# EasyEDA Pro project OPS9.epro

# Schematic Schematic1
Board Name: Board1; Create Date: 2024-11-01; Page Name: P1; Project Name: ops9; Schematic Name: Schematic1; Update Date: 2024-11-03; Company: 嘉立创EDA; Page Size: A4; Version: V1.0
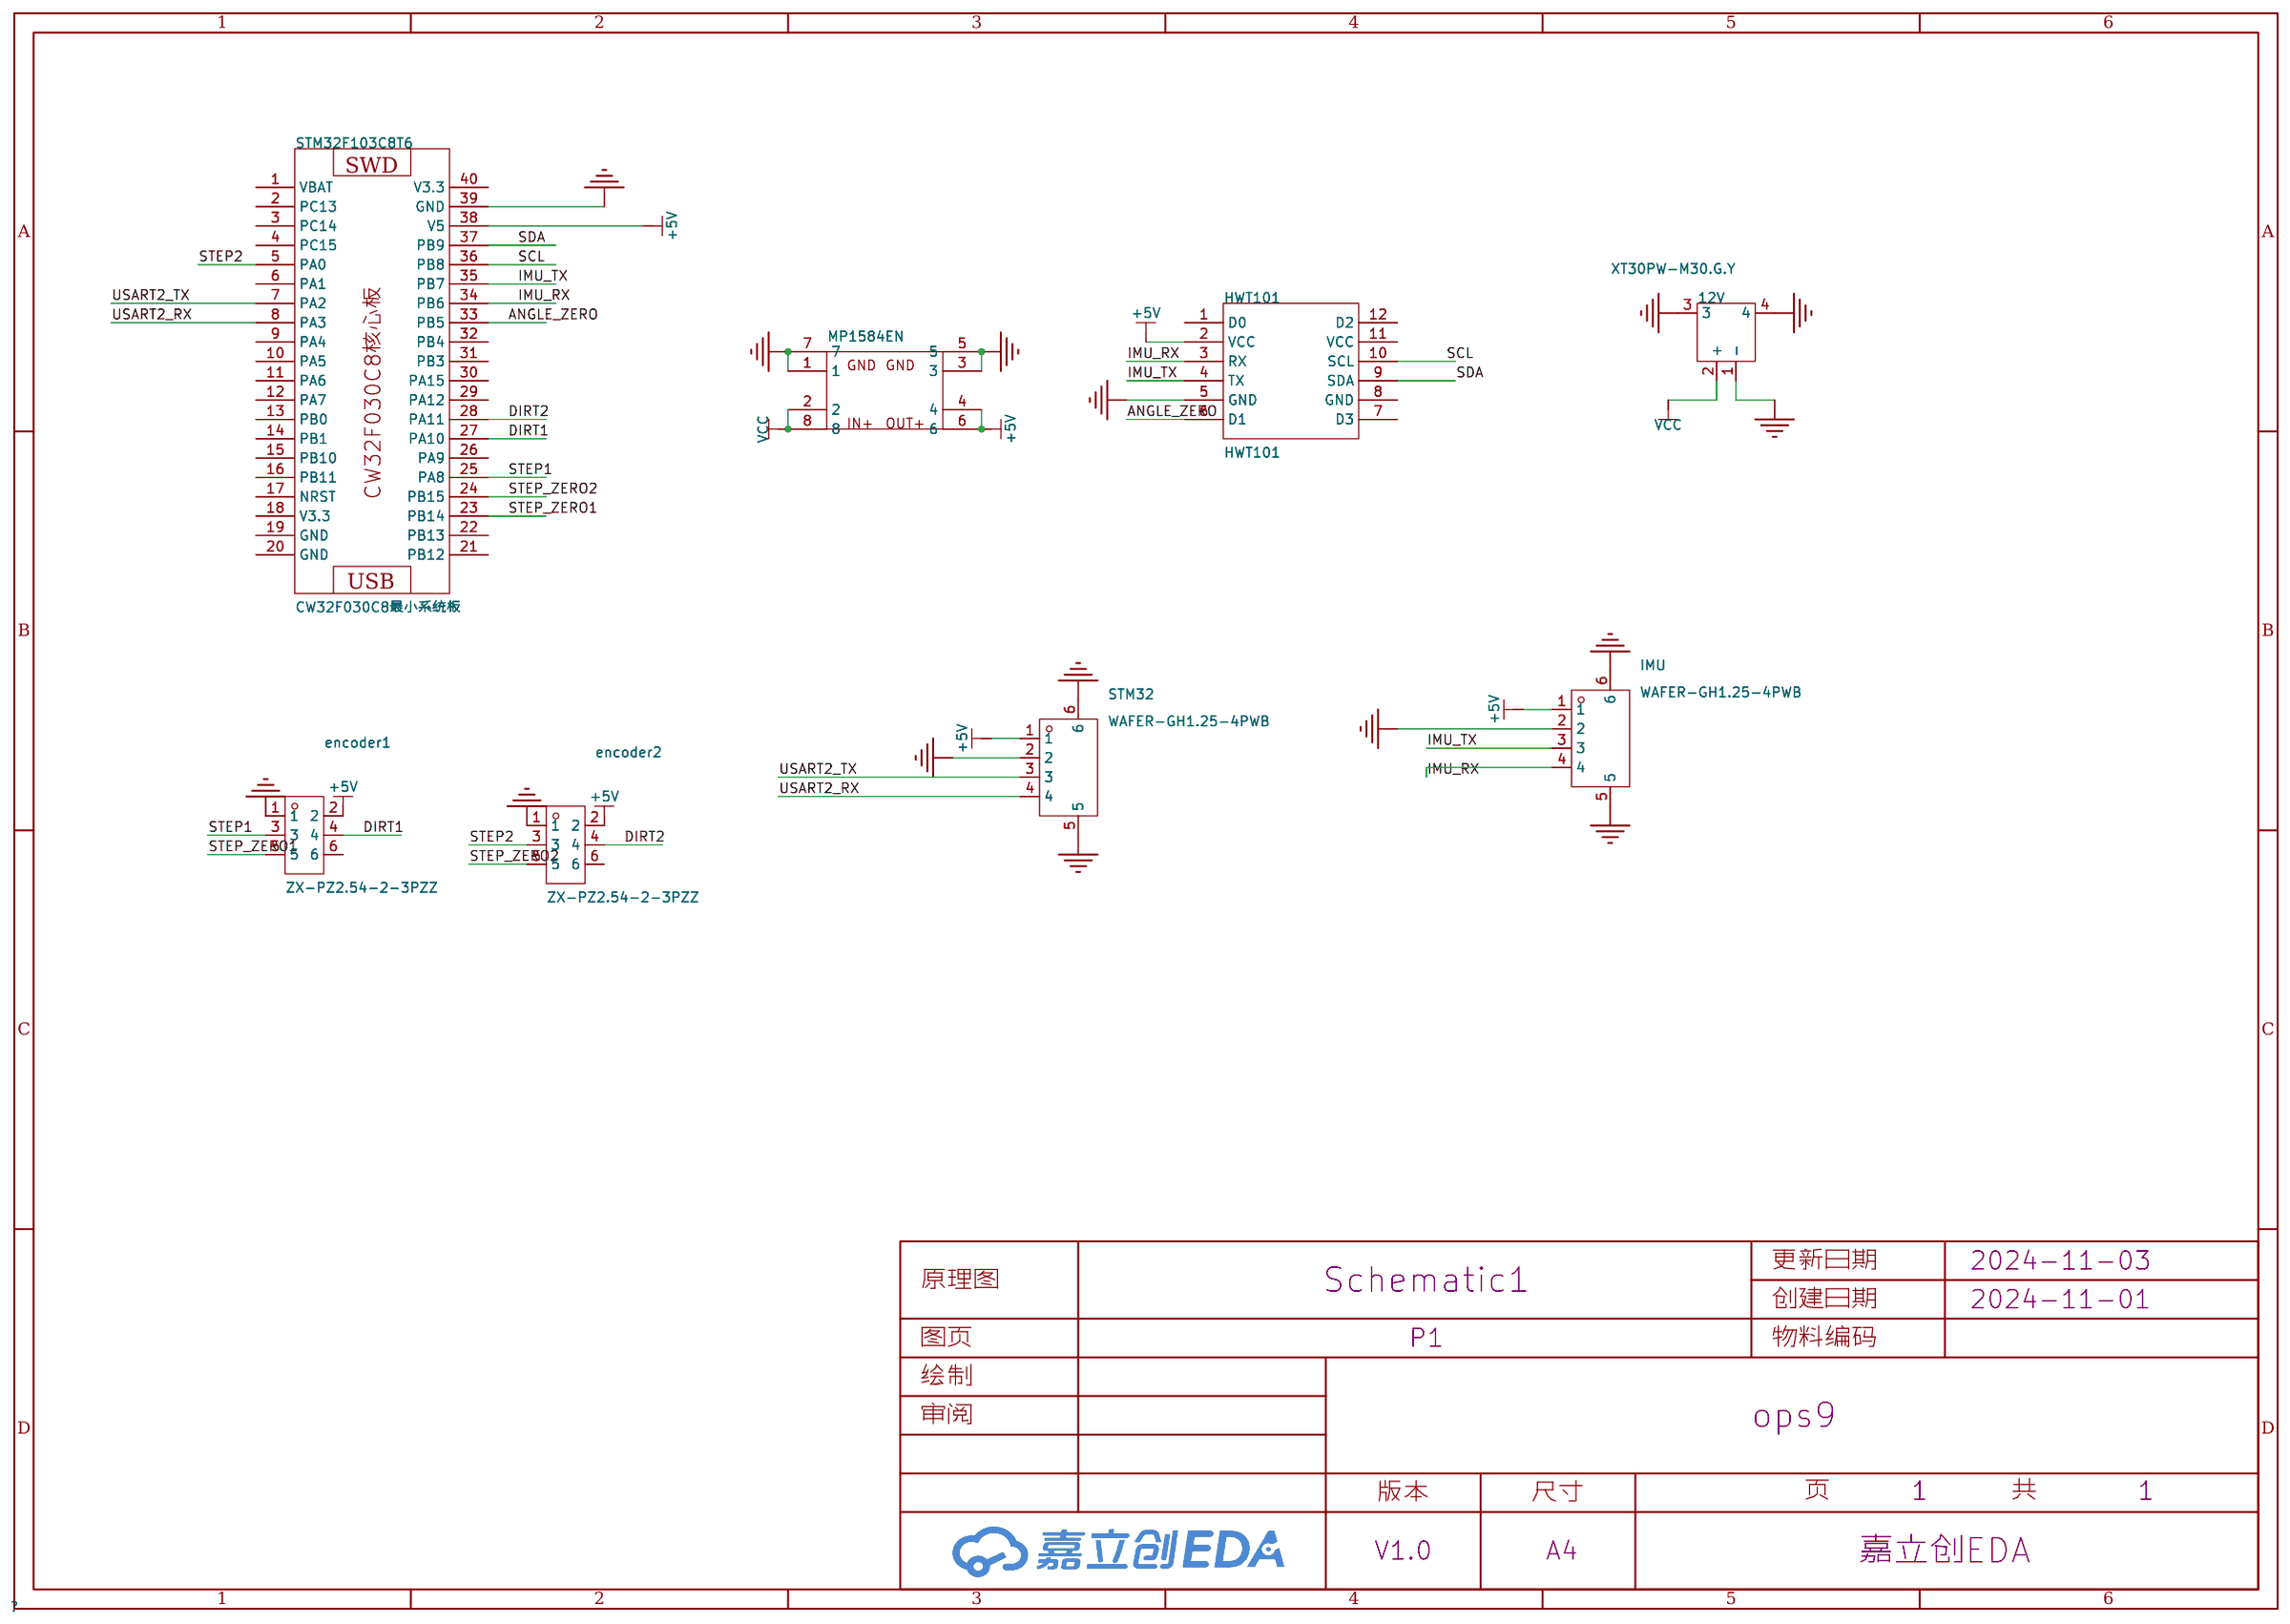
[diagram p0: schematic sheet]

## Parts
12V  XT30PW-M30.G.Y  [CONN-TH_XT30PW-M]
encoder1  ZX-PZ2.54-2-3PZZ  [HDR-TH_6P-P2.54-V-M-R2-C3-S2.54-1]
encoder2  ZX-PZ2.54-2-3PZZ  [HDR-TH_6P-P2.54-V-M-R2-C3-S2.54-1]
HWT101  HWT101  [HWT101]
IMU  WAFER-GH1.25-4PWB  [CONN-SMD_4P-P1.25_XUNPU_WAFER-GH1.25-4PWB]
MP1584EN  -  [LM1584EN]
STM32  WAFER-GH1.25-4PWB  [CONN-SMD_4P-P1.25_XUNPU_WAFER-GH1.25-4PWB]
STM32F103C8T6  CW32F030C8最小系统板  [STM32F103C8T6核心板]

## Library data of the parts
12V = XT30PW-M30.G.Y: 类别:-;类型1:-;; LCSC Part Name: AMASS(艾迈斯)航模插头 卧式弯脚 XT30PW-M公头; Supplier Part: C431092; Manufacturer: AMASS(艾迈斯); JLCPCB Part Class: 扩展库; Datasheet: https://atta.szlcsc.com/upload/public/pdf/source/20220222/6A9F22F7850E25B33E1BE430ADF8560B.pdf; Supplier: LCSC; Type: 航模插头; RatedVoltage: DC 500V; InterfaceType: 公头; RatedCurrent: 15A; RecommendedWireGauge: 16/18/20AWG; contact resistance: 1.2mΩ; specifications: 2pin
encoder1 encoder2 = ZX-PZ2.54-2-3PZZ: 插针结构:2x3P;间距:2.54mm;行距:2.54mm;圆针/方针:方针;安装类型:直插;排数:双排;总PIN位数:6P;额定电流:3A;额定电压:1kV;配合针长度:6mm;塑高:2.5mm;端接针长度:3mm;触头材质:黄铜;触头镀层:金;工作温度范围:-40℃~+105℃;焊接温度(最大值):-;颜色:黑色;; LCSC Part Name: 2x3P 间距:2.54mm 方针 直插; Supplier Part: C7501274; Manufacturer: Megastar(兆星); Supplier Footprint: 插件,P=2.54mm; JLCPCB Part Class: 扩展库; Datasheet: https://atta.szlcsc.com/upload/public/pdf/source/20231122/E8390501A702A71E626C593F036B3607.pdf; Supplier: LCSC; Pin Structure: 2x3P; Pitch: 2.54mm; Row Spacing: 2.54mm; Circluar Pins/Square Pins: 方针; Mounting Type: 直插; Number of Rows: 双排; Number of Pins: 6P; Current Rating (Max): 3A; Voltage Rating (Max): 1kV; Length of Mating Pin: 6mm; Insulation Height: 2.5mm; Length of End Connection Pin: 3mm; Contact Material: 黄铜; Contact Plating: 金; Operating Temperature Range: -40℃~+105℃; Color: 黑色
HWT101 = HWT101: _: 3
IMU STM32 = WAFER-GH1.25-4PWB: 插针结构:1x4P;间距:1.25mm;安装方式:卧贴;参考系列:GH;总PIN数:4P;排数:1;每排PIN数:4;额定电流:1A;工作温度范围:-25℃~+85℃;; LCSC Part Name: 1x4P 间距:1.25mm 卧贴 系列:GH; Supplier Part: C3029379; Manufacturer: XUNPU(讯普); Supplier Footprint: SMD,P=1.25mm,卧贴; JLCPCB Part Class: 扩展库; Datasheet: https://atta.szlcsc.com/upload/public/pdf/source/20220527/CB8773BFB0913C3B8ABD62CB38BA101A.pdf; Supplier: LCSC; Pins Structure: 1x4P; Pitch: 1.25mm; Mounting Style: 卧贴; Reference Series: GH; Number of Pins: 4P; Number of Rows: 1; Number of PINs Per Row: 4; Current Rating (Max): 1A; Operating Temperature Range: -25℃~+85℃
MP1584EN = MP1584EN
STM32F103C8T6 = CW32F030C8最小系统板: tags: STM32; Supplier Part: C8734; Manufacturer: 无; Manufacturer Part: STM32F103C8T6最小系统模块; image: http://image.lceda.cn/szlcsc/C8734.jpg; JLCPCB Part Class: Basic Part

## Nets
+5V: encoder1.2 encoder2.2 HWT101.2(VCC) IMU.1 MP1584EN.4 MP1584EN.6 STM32.1 STM32F103C8T6.38(V5)
GND: 12V.1(-) 12V.3 12V.4 encoder1.1 encoder2.1 HWT101.5(GND) IMU.2 IMU.5 IMU.6 MP1584EN.1 MP1584EN.3 MP1584EN.5 MP1584EN.7 STM32.2 STM32.5 STM32.6 STM32F103C8T6.39(GND)
VCC: 12V.2(+) MP1584EN.2 MP1584EN.8
ANGLE_ZERO: HWT101.6(D1) STM32F103C8T6.33(PB5)
DIRT1: encoder1.4 STM32F103C8T6.27(PA10)
DIRT2: encoder2.4 STM32F103C8T6.28(PA11)
IMU_RX: HWT101.3(RX) IMU.4 STM32F103C8T6.34(PB6)
IMU_TX: HWT101.4(TX) IMU.3 STM32F103C8T6.35(PB7)
SCL: HWT101.10(SCL) STM32F103C8T6.36(PB8)
SDA: HWT101.9(SDA) STM32F103C8T6.37(PB9)
STEP1: encoder1.3 STM32F103C8T6.25(PA8)
STEP2: encoder2.3 STM32F103C8T6.5(PA0)
STEP_ZERO1: encoder1.5 STM32F103C8T6.23(PB14)
STEP_ZERO2: encoder2.5 STM32F103C8T6.24(PB15)
USART2_RX: STM32.4 STM32F103C8T6.8(PA3)
USART2_TX: STM32.3 STM32F103C8T6.7(PA2)

Not connected (* = marked no-connect by the designer): encoder1 6; encoder2 6; HWT101 1(D0) 7(D3) 8(GND) 11(VCC) 12(D2); STM32F103C8T6 1(VBAT) 2(PC13) 3(PC14) 4(PC15) 6(PA1) 9(PA4) 10(PA5) 11(PA6) 12(PA7) 13(PB0) 14(PB1) 15(PB10) 16(PB11) 17(NRST) 18(V3.3) 19(GND) 20(GND) 21(PB12) 22(PB13) 26(PA9) 29(PA12) 30(PA15) 31(PB3) 32(PB4) 40(V3.3)

# Board PCB1
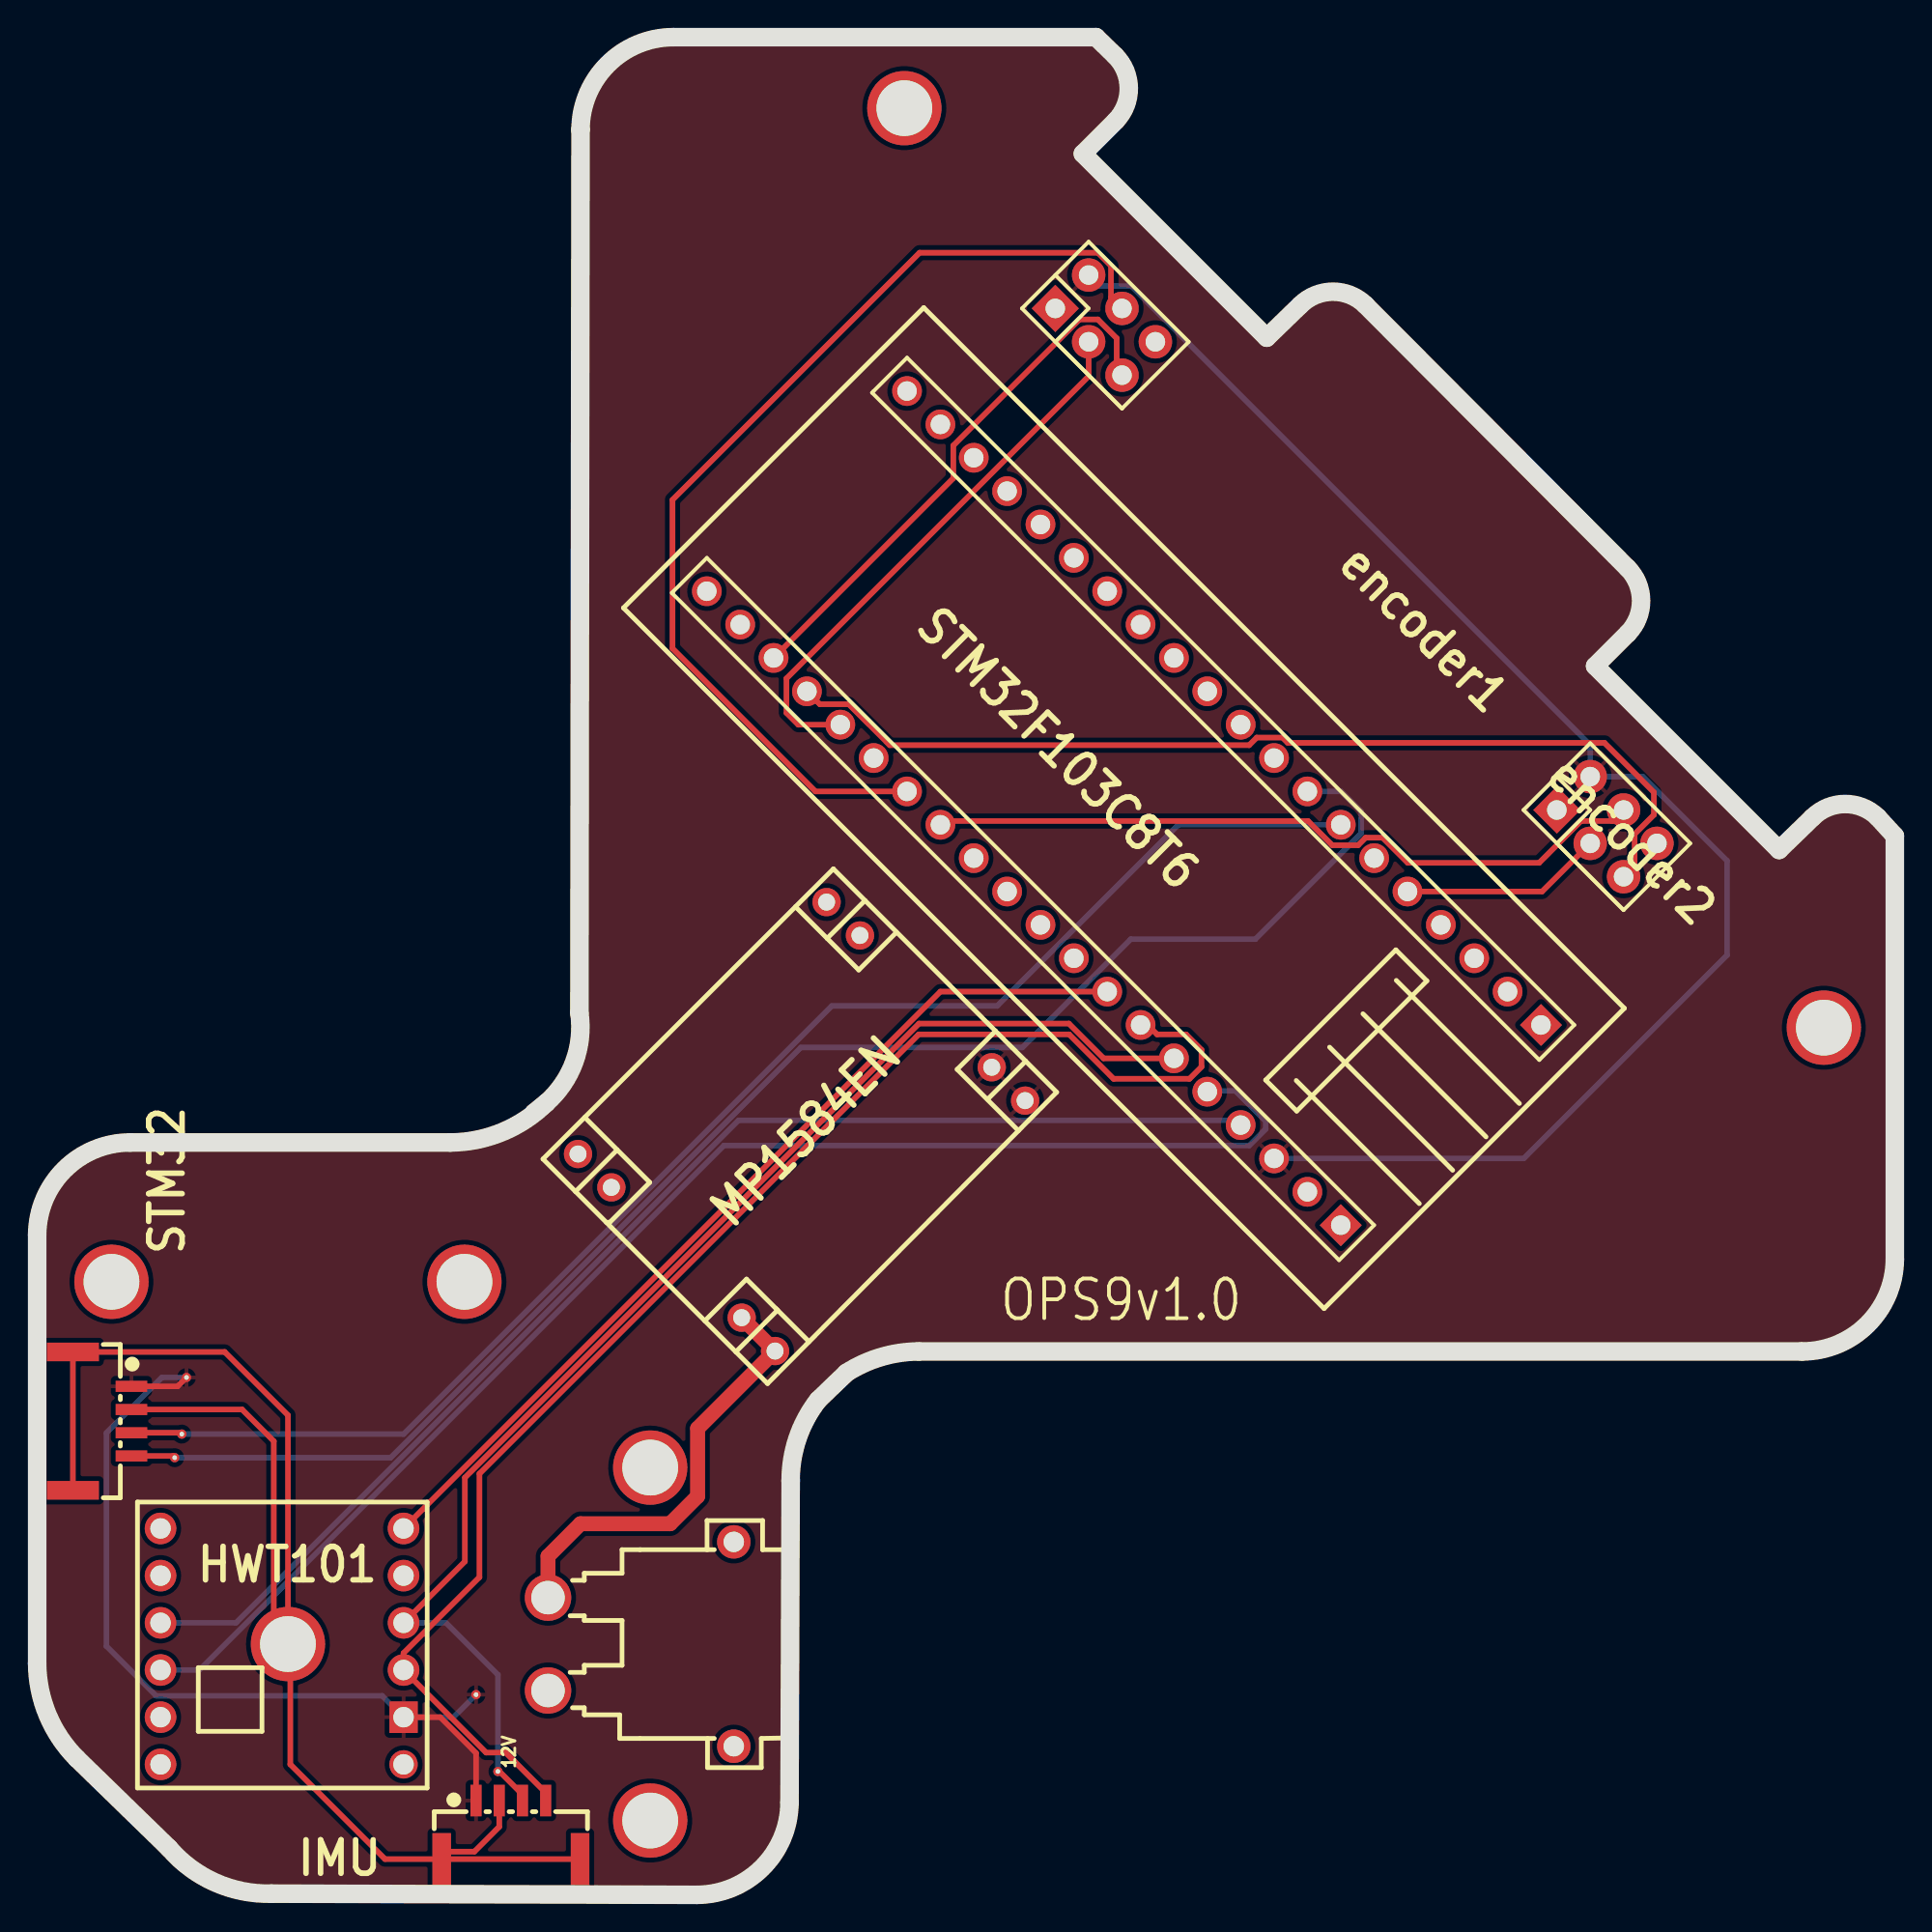
[diagram p1: board, top side]
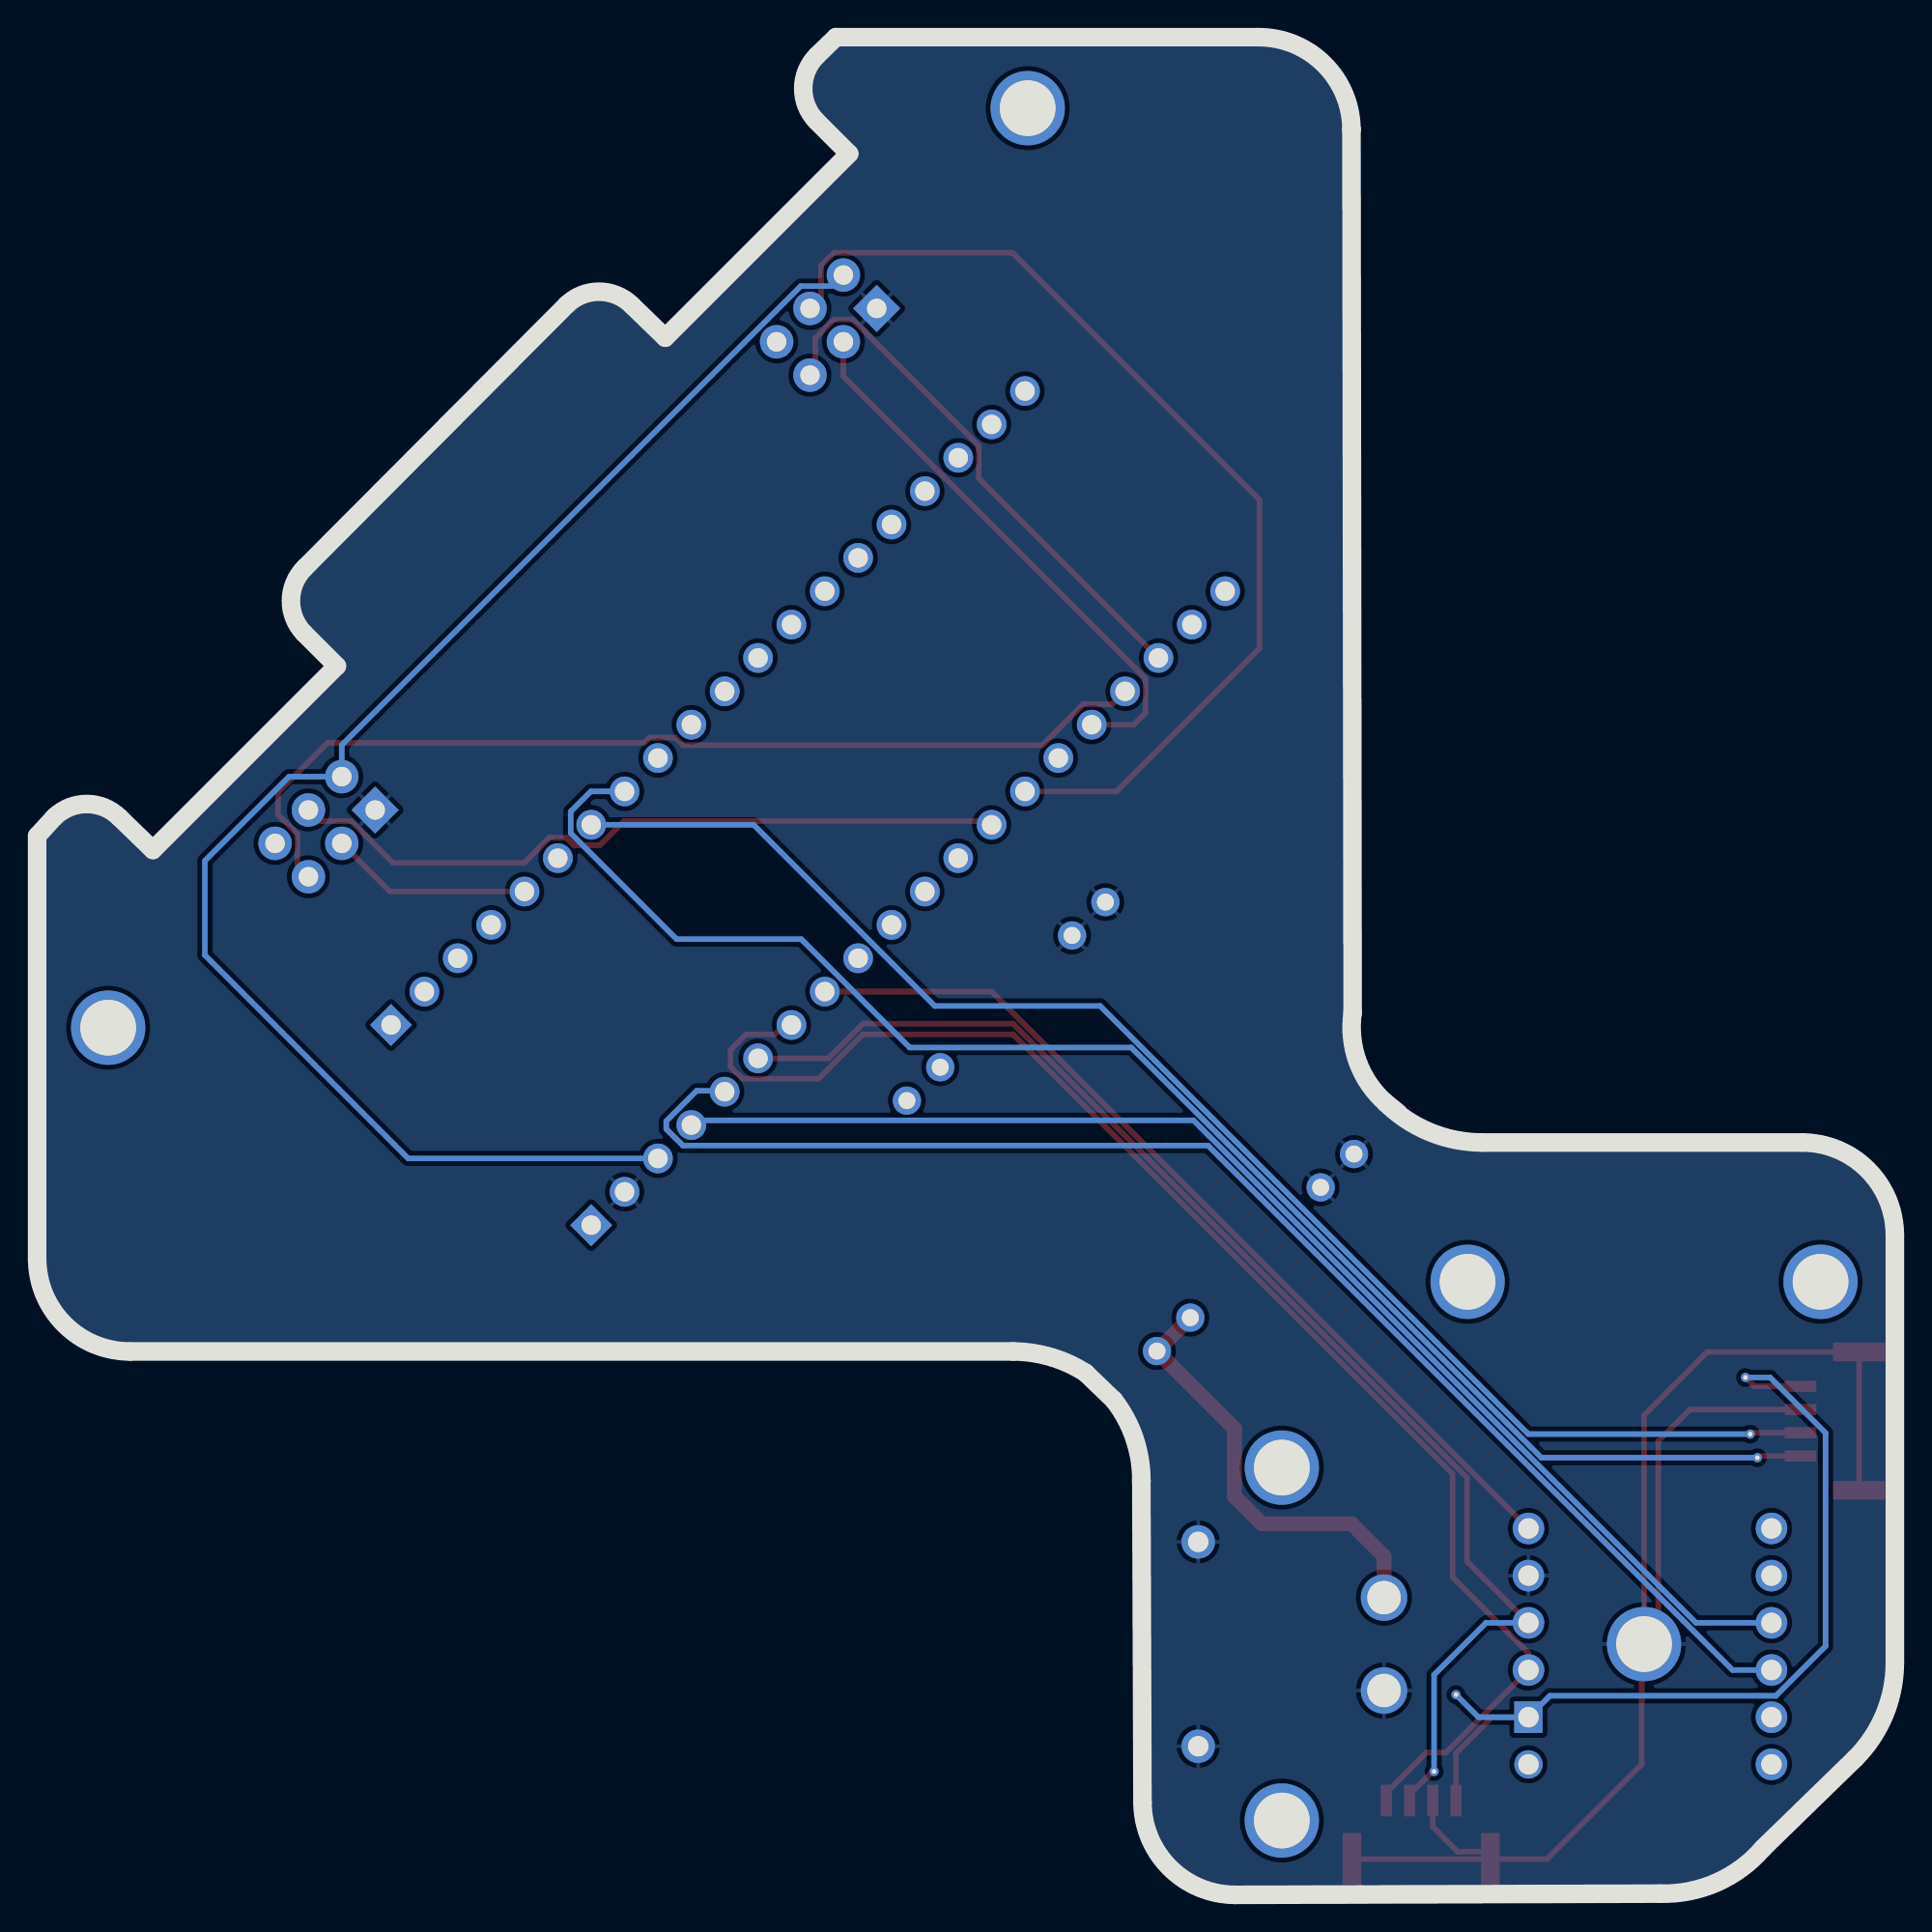
[diagram p2: board, bottom side, seen from below]

Outline 100 x 100 mm; copper layers: Top Layer, Bottom Layer. Coordinates in mm from the lower left corner of the outline.
Outline path: 27.41,42.64 arc(25.04,41.06) 22.25,40.5 5,40.5 arc(1.48,39.05) 0,35.53 0,12.45 arc(0.56,9.69) 2.14,7.34 7.1,2.51 arc(9.58,0.67) 12.61,0.06 35.5,0 arc(39.02,1.45) 40.5,4.97 40.56,22.32 40.56,22.27 arc(40.93,24.58) 42.04,26.63 43.57,28.1 arc(45.43,28.95) 47.45,29.25 95,29.25 arc(98.52,30.7) 100,34.22 100,57 99.07,58.02 arc(97.31,58.72) 95.56,57.99 93.77,56.25 83.87,66.15 85.64,67.92 arc(86.34,69.67) 85.61,71.42 71.49,85.59 arc(69.73,86.3) 67.99,85.57 66.19,83.83 56.29,93.72 58.06,95.49 arc(58.76,97.25) 58.03,99 57,100 34.25,100 arc(30.73,98.55) 29.25,95.03 29.25,95 29.19,47.48 arc(28.91,44.83) 27.41,42.64 ; 27.41,42.64 26.74,42.1
Stack: Top Layer 0.035mm / Dielectric1 1.51mm FR4 er 4.5 / Bottom Layer 0.035mm

## Design rules (mm)
template: JLCPCB Capability(Two Layers Board)
spacing copperThickness1oz (default): track to track 0.102, other pairs 0.152 to 0.3
spacing copperThickness2oz: track to track 0.203, other pairs 0.152 to 0.3
track width copperThickness1oz (default): min 0.127, default 0.254, max 2.54
track width copperThickness2oz: min 0.203, default 0.254, max 2.54
differential pair differentialPair (default): width min 0.127, default 0.254, max 2.54; gap min 0.152, default 0.152
via viaSize (default): diameter min 0.5, default 0.61, max 10; hole min 0.3, default 0.305, max 6.3

## Placement (name value [footprint] x y rotation side)
12V  XT30PW-M30.G.Y  [CONN-TH_XT30PW-M]  32.5 13.5 90 top
encoder1  ZX-PZ2.54-2-3PZZ  [HDR-TH_6P-P2.54-V-M-R2-C3-S2.54-1]  57.5 84.5 315 top
encoder2  ZX-PZ2.54-2-3PZZ  [HDR-TH_6P-P2.54-V-M-R2-C3-S2.54-1]  84.5 57.5 315 top
HWT101  -  [HWT101]  13.5 13.5 180 top
IMU  WAFER-GH1.25-4PWB  [CONN-SMD_4P-P1.25_XUNPU_WAFER-GH1.25-4PWB]  25.5 3.5 0 top
MP1584EN  -  [LM1584EN]  38.77 42.08 45 top
NOREF  -  [Pad_e398]  7.4 23.53 0 top
NOREF#2  -  [Pad_e28]  23 33 0 top
NOREF#3  -  [Pad_e22]  33 23 0 top
NOREF#4  -  [Pad_e56]  96.18 46.68 0 top
NOREF#5  -  [Pad_e1201]  24.8 6.64 0 top
NOREF#6  -  [Pad_e33]  33 4 0 top
NOREF#7  -  [Pad_e1805]  23.62 10.78 0 top
NOREF#8  -  [Pad_e1290]  8.04 27.85 0 top
NOREF#9  -  [Pad_e15]  13.5 13.5 180 top
NOREF#10  -  [Pad_e397]  7.78 24.8 0 top
NOREF#11  -  [Pad_e53]  46.68 96.18 0 top
NOREF#12  -  [Pad_e30]  4 33 0 top
STM32  WAFER-GH1.25-4PWB  [CONN-SMD_4P-P1.25_XUNPU_WAFER-GH1.25-4PWB]  3.5 25.5 270 top
STM32F103C8T6  CW32F030C8最小系统板  [STM32F103C8T6核心板]  58.5 58.5 225 top

## Footprints (pads in the part's own frame, mm; a bottom-side part is the same pattern mirrored in y, then rotated)
CONN-SMD_4P-P1.25_XUNPU_WAFER-GH1.25-4PWB
  rect 0.6x1.7 smd: 1(-1.875,1.575) 2(-0.625,1.575) 3(0.625,1.575) 4(1.875,1.575)
  rect 1x2.8 smd: 5(3.725,-1.575) 6(-3.725,-1.575)
CONN-TH_XT30PW-M
  round 2.5 hole 1.8: 1(-2.5,5) 2(2.5,5)
  round 1.8 hole 1.1: 3(5.5,-5) 4(-5.5,-5)
HDR-TH_6P-P2.54-V-M-R2-C3-S2.54-1
  rect 1.8x1.8 hole 1.05: 1(-2.54,-1.27)
  round 1.8 hole 1.05: 2(-2.54,1.27) 3(0,-1.27) 4(0,1.27) 5(2.54,-1.27) 6(2.54,1.27)
HWT101
  round 1.524 hole 1.1: 1(-6.223,6.477)
  rect 1.524x1.7 hole 1.1: 2(-6.223,3.937)
  round 1.7 hole 1.1: 3(-6.223,1.397) 4(-6.223,-1.143) 5(-6.223,-3.683) 6(-6.223,-6.223) 7(6.858,-6.223) 8(6.858,-3.683) 9(6.858,-1.143) 10(6.858,1.397) 11(6.858,3.937) 12(6.858,6.477)
LM1584EN
  round 1.524 hole 0.914: 1(-8.382,2.737) 2(-8.382,-7.182) 3(10.668,2.865) 4(10.668,-7.168) 5(10.668,5.404) 6(10.668,-9.709) 7(-8.382,5.277) 8(-8.382,-9.723)
Pad_e15
  round 4 hole 3: 1(0,0)
Pad_e22
  round 4 hole 3: 1(0,0)
Pad_e28
  round 4 hole 3: 1(0,0)
Pad_e30
  round 4 hole 3: 2(0,0)
Pad_e33
  round 4 hole 3: 1(0,0)
Pad_e53
  round 4 hole 3: 1(0,0)
Pad_e56
  round 4 hole 3: 1(0,0)
Pad_e397
  round 0.5 hole 0.25: 1(0,0)
Pad_e398
  round 0.5 hole 0.25: 2(0,0)
Pad_e1201
  round 0.5 hole 0.25: 1(0,0)
Pad_e1290
  round 0.5 hole 0.25: 1(0,0)
Pad_e1805
  round 0.5 hole 0.25: 1(0,0)
STM32F103C8T6核心板
  rect 1.6x1.6 hole 1.049: 1(-7.62,24.13) 40(7.62,24.13)
  round 1.6 hole 1.049: 2(-7.62,21.59) 3(-7.62,19.05) 4(-7.62,16.51) 5(-7.62,13.97) 6(-7.62,11.43) 7(-7.62,8.89) 8(-7.62,6.35) 9(-7.62,3.81) 10(-7.62,1.27) 11(-7.62,-1.27) 12(-7.62,-3.81) 13(-7.62,-6.35) 14(-7.62,-8.89) 15(-7.62,-11.43) 16(-7.62,-13.97) 17(-7.62,-16.51) 18(-7.62,-19.05) 19(-7.62,-21.59) 20(-7.62,-24.13) 21(7.62,-24.13) 22(7.62,-21.59) 23(7.62,-19.05) 24(7.62,-16.51) 25(7.62,-13.97) 26(7.62,-11.43) 27(7.62,-8.89) 28(7.62,-6.35) 29(7.62,-3.81) 30(7.62,-1.27) 31(7.62,1.27) 32(7.62,3.81) 33(7.62,6.35) 34(7.62,8.89) 35(7.62,11.43) 36(7.62,13.97) 37(7.62,16.51) 38(7.62,19.05) 39(7.62,21.59)

## Nets
+5V: encoder1.2 encoder2.2 HWT101.2 IMU.1 MP1584EN.4 MP1584EN.6 NOREF#7.1 NOREF#8.1 STM32.1 STM32F103C8T6.38
GND: 12V.1 12V.3 12V.4 encoder1.1 encoder2.1 HWT101.5 IMU.2 IMU.5 IMU.6 MP1584EN.1 MP1584EN.3 MP1584EN.5 MP1584EN.7 NOREF#9.1 STM32.2 STM32.5 STM32.6 STM32F103C8T6.39
VCC: 12V.2 MP1584EN.2 MP1584EN.8
ANGLE_ZERO: HWT101.6 STM32F103C8T6.33
DIRT1: encoder1.4 STM32F103C8T6.27
DIRT2: encoder2.4 STM32F103C8T6.28
IMU_RX: HWT101.3 IMU.4 STM32F103C8T6.34
IMU_TX: HWT101.4 IMU.3 NOREF#5.1 STM32F103C8T6.35
SCL: HWT101.10 STM32F103C8T6.36
SDA: HWT101.9 STM32F103C8T6.37
STEP1: encoder1.3 STM32F103C8T6.25
STEP2: encoder2.3 STM32F103C8T6.5
STEP_ZERO1: encoder1.5 STM32F103C8T6.23
STEP_ZERO2: encoder2.5 STM32F103C8T6.24
USART2_RX: NOREF.2 STM32.4 STM32F103C8T6.8
USART2_TX: NOREF#10.1 STM32.3 STM32F103C8T6.7

Pads without a net: encoder1 6; encoder2 6; HWT101 1 7 8 11 12; NOREF#2 1; NOREF#3 1; NOREF#4 1; NOREF#6 1; NOREF#11 1; NOREF#12 2; STM32F103C8T6 1 2 3 4 6 9 10 11 12 13 14 15 16 17 18 19 20 21 22 26 29 30 31 32 40

## Routing (per net, layer and track width the routed paths; a pad name or vN(x,y) marks a point on that pad's centre or on a via; arc(x,y) is an arc through that point)
+5V: length 131.9
  Top Layer w0.3: NOREF#8.1 7.56,27.38 STM32.1 ; IMU.1 23.62,7.63 21.69,9.56 HWT101.2
  Bottom Layer w0.3: NOREF#7.1 22.41,9.56 HWT101.2 18.57,10.72 6.4,10.72 3.73,13.39 3.73,24.87 6.71,27.85 NOREF#8.1 ; encoder1.2 57.2,86.6 58.9,86.6 83.6,61.89 encoder2.2 86.44,60.19 90.97,55.66 90.97,50.58 80.03,39.64 STM32F103C8T6.38
GND: length 81.8
  Top Layer w0.3: IMU.5 IMU.6 ; IMU.6 18.72,1.93 13.63,7.02 13.63,13.37 NOREF#9.1 ; IMU.6 22.17,2.32 23.53,2.32 24.88,3.67 IMU.2 ; STM32.5 STM32.6 10.09,29.22 13.5,25.82 NOREF#9.1 ; NOREF#9.1 12.74,14.26 12.74,24.42 11.03,26.12 STM32.2
VCC: length 23.7
  Top Layer w0.8: 12V.2 27.5,18.23 29.25,19.98 34.07,19.98 35.55,21.46 35.55,25.1 39.72,29.27 37.93,31.07
ANGLE_ZERO: length 49.8
  Top Layer w0.3: STM32F103C8T6.33 48.62,48.62 HWT101.6
DIRT1: length 55.8
  Top Layer w0.3: STM32F103C8T6.27 41.9,59.4 34.2,67.09 34.2,75.09 47.5,88.4 57.1,88.4 57.8,87.69 57.8,85.99 encoder1.4
DIRT2: length 39.3
  Top Layer w0.3: encoder2.4 84.8,57.8 83.1,57.8 80.85,55.55 73.78,55.55 72.43,56.91 71.51,56.91 71.11,56.5 69.72,56.5 68.41,57.8 48.82,57.8 STM32F103C8T6.28
IMU_RX: length 77.7
  Top Layer w0.3: STM32F103C8T6.34 59.78,46.83 60.29,46.32 61.85,46.32 62.68,45.49 62.68,44.57 62.03,43.93 57.94,43.93 55.55,46.32 47.45,46.32 23.81,22.67 23.81,17.1 19.72,13.01 HWT101.3 24.17,7.66 25.22,7.66 27.38,5.5 IMU.4
IMU_TX: length 71.9
  Top Layer w0.3: STM32F103C8T6.35 57.41,45.03 55.54,46.9 47.47,46.9 23.03,22.46 23.03,17.94 HWT101.4 ; NOREF#5.1 24.89,6.64 26.12,5.4 IMU.3
  Bottom Layer w0.3: HWT101.4 22.01,14.64 24.8,11.85 NOREF#5.1
SCL: length 75.8
  Bottom Layer w0.3: STM32F103C8T6.36 63.04,43.28 64.5,43.28 66.13,41.65 66.13,41.23 65.24,40.34 36.97,40.34 8.73,12.1 HWT101.10
SDA: length 69.5
  Bottom Layer w0.3: HWT101.9 10.71,14.64 37.75,41.69 64.53,41.69 STM32F103C8T6.37
STEP1: length 29.9
  Top Layer w0.3: encoder1.3 56.6,81.75 40.34,65.48 40.34,63.63 40.97,62.99 STM32F103C8T6.25
STEP2: length 10.9
  Top Layer w0.3: encoder2.3 81.01,54.01 STM32F103C8T6.5
STEP_ZERO1: length 29.6
  Top Layer w0.3: encoder1.5 58.28,81.81 58.11,81.98 58.11,83.79 57.1,84.8 56.1,84.8 49.32,78.02 49.32,76.26 STM32F103C8T6.23
STEP_ZERO2: length 53.4
  Top Layer w0.3: encoder2.5 85.99,55.4 85.99,57.1 87.03,58.14 87.03,59.35 84.37,62.01 67.32,62.01 67.04,62.3 65.65,62.3 65.24,61.89 45.89,61.89 43.69,64.09 42.13,64.09 STM32F103C8T6.24
USART2_RX: length 84.7
  Top Layer w0.3: NOREF.2 7.31,23.62 STM32.4
  Bottom Layer w0.3: NOREF.2 19.03,23.53 41.11,45.61 53.03,45.61 58.87,51.45 65.58,51.45 71.28,57.15 71.28,58.31 70.19,59.4 STM32F103C8T6.8
USART2_TX: length 78.7
  Top Layer w0.3: NOREF#10.1 7.71,24.88 STM32.3
  Bottom Layer w0.3: STM32F103C8T6.7 61.43,57.6 51.68,47.85 42.78,47.85 19.73,24.8 NOREF#10.1

## Copper pours and planes (outline as drawn; the poured copper is in the pictures)
+5V on Top Layer: -5.3,107.61 110.66,107.61 110.66,-4.15 -5.3,-4.15
GND on Bottom Layer: -2.38,106.97 112.56,106.97 112.56,-4.15 -2.38,-4.15

## Text on the board
Top Silkscreen Layer: OPS9v1.0
